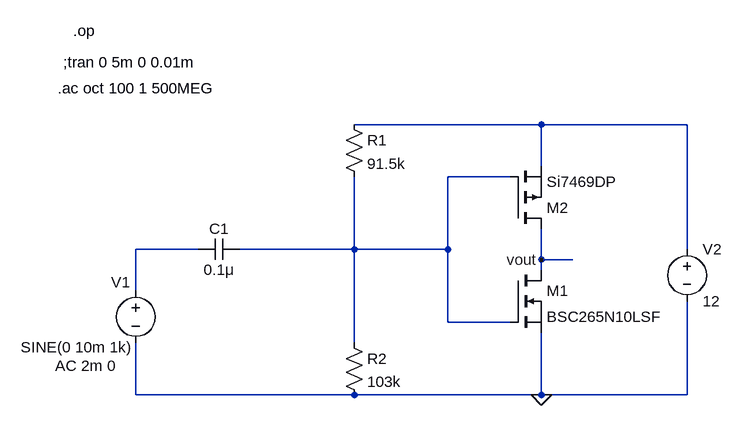
[diagram p0: schematic Cmos.asc]
Cmos.asc, the LTspice schematic file:
Version 4
SHEET 1 880 680
WIRE 128 -368 -160 -368
WIRE 352 -368 128 -368
WIRE 128 -304 128 -368
WIRE 80 -288 -16 -288
WIRE -400 -176 -496 -176
WIRE -160 -176 -160 -288
WIRE -160 -176 -336 -176
WIRE -16 -176 -16 -288
WIRE -16 -176 -160 -176
WIRE 352 -176 352 -368
WIRE 128 -160 128 -208
WIRE 176 -160 128 -160
WIRE 128 -144 128 -160
WIRE -496 -112 -496 -176
WIRE -16 -64 -16 -176
WIRE 80 -64 -16 -64
WIRE -160 -32 -160 -176
WIRE -496 48 -496 -32
WIRE -160 48 -496 48
WIRE 128 48 128 -48
WIRE 128 48 -160 48
WIRE 352 48 352 -96
WIRE 352 48 128 48
FLAG 128 48 0
FLAG 128 -160 vout
SYMBOL nmos 80 -144 R0
SYMATTR InstName M1
SYMATTR Value BSC265N10LSF
SYMBOL pmos 80 -208 M180
SYMATTR InstName M2
SYMATTR Value Si7469DP
SYMBOL res -176 -384 R0
SYMATTR InstName R1
SYMATTR Value 91.5k
SYMBOL res -176 -48 R0
SYMATTR InstName R2
SYMATTR Value 103k
SYMBOL cap -336 -192 R90
WINDOW 0 0 32 VBottom 2
WINDOW 3 32 32 VTop 2
SYMATTR InstName C1
SYMATTR Value 0.1μ
SYMBOL voltage -496 -128 R0
WINDOW 0 -38 3 Left 2
WINDOW 3 -177 103 Left 2
WINDOW 123 -124 131 Left 2
WINDOW 39 0 0 Left 0
SYMATTR InstName V1
SYMATTR Value SINE(0 10m 1k)
SYMATTR Value2 AC 2m 0
SYMBOL voltage 352 -192 R0
SYMATTR InstName V2
SYMATTR Value 12
TEXT -608 -464 Left 2 !;tran 0 5m 0 0.01m
TEXT -616 -424 Left 2 !.ac oct 100 1 500MEG
TEXT -592 -512 Left 2 !.op

The netlist it stands for:
* Cmos.asc
M1 vout N002 0 0 BSC265N10LSF
M2 vout N002 N001 N001 Si7469DP
R1 N001 N002 91.5k
R2 N002 0 103k
C1 N002 N003 0.1μ
V1 N003 0 SINE(0 10m 1k) AC 2m 0
V2 N001 0 12
.model NMOS NMOS
.model PMOS PMOS
.lib standard.mos
;tran 0 5m 0 0.01m
.ac oct 100 1 500MEG
.op
.backanno
.end